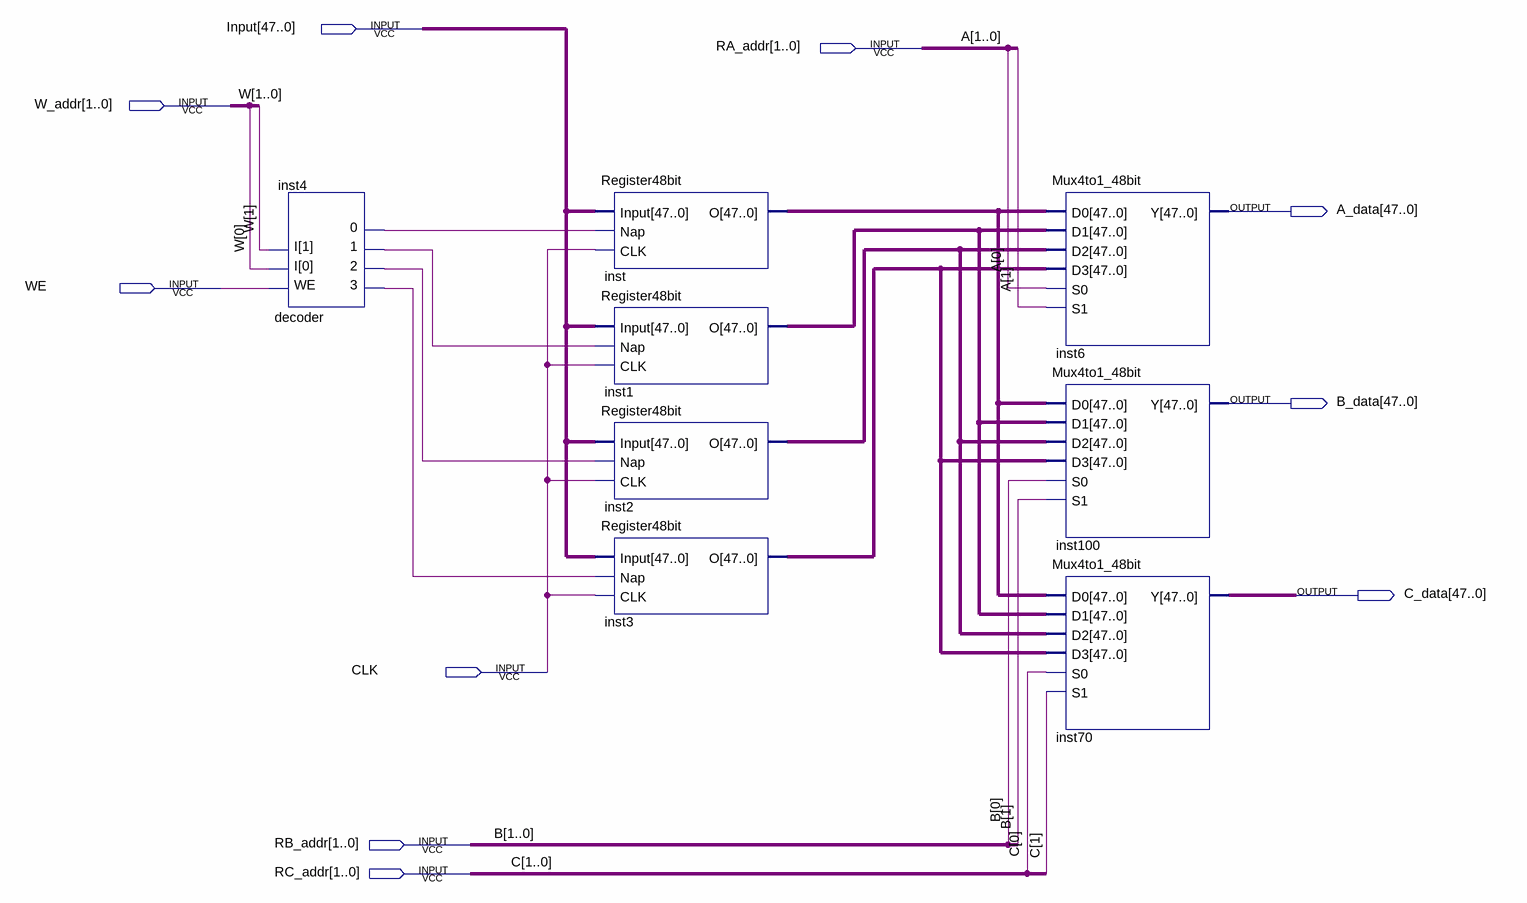
[diagram p0: schematic sheet]
// Quartus schematic Register4_48bit.bdf as structural Verilog: 8 symbols, 10 pins
module Register4_48bit (
  input  [47:0] Input,
  input  [1:0] RA_addr,
  input  [1:0] W_addr,
  input  WE,
  input  CLK,
  input  [1:0] RB_addr,
  input  [1:0] RC_addr,
  output [47:0] A_data,
  output [47:0] B_data,
  output [47:0] C_data
);

  wire inst4_0, inst4_1, inst4_2, inst4_3;
  wire [47:0] inst1_o, inst2_o, inst3_o, inst_o;

  decoder inst4 (.WE(WE), .I(W_addr), .\3 (inst4_3), .\2 (inst4_2), .\1 (inst4_1), .\0 (inst4_0));
  Register48bit inst (.Input(Input), .Nap(inst4_0), .CLK(CLK), .O(inst_o));
  Register48bit inst1 (.Input(Input), .Nap(inst4_1), .CLK(CLK), .O(inst1_o));
  Register48bit inst2 (.Input(Input), .Nap(inst4_2), .CLK(CLK), .O(inst2_o));
  Register48bit inst3 (.Input(Input), .Nap(inst4_3), .CLK(CLK), .O(inst3_o));
  Mux4to1_48bit inst6 (
    .D0(inst_o), .D1(inst1_o), .D2(inst2_o), .D3(inst3_o), .S0(RA_addr[0]), .S1(RA_addr[1]), .Y(A_data));
  Mux4to1_48bit inst100 (
    .D0(inst_o), .D1(inst1_o), .D2(inst2_o), .D3(inst3_o), .S0(RB_addr[0]), .S1(RB_addr[1]), .Y(B_data));
  Mux4to1_48bit inst70 (
    .D0(inst_o), .D1(inst1_o), .D2(inst2_o), .D3(inst3_o), .S0(RC_addr[0]), .S1(RC_addr[1]), .Y(C_data));

  // Other names for the same wires on the sheet: A[1:0] = RA_addr; B[1:0] = RB_addr; C[1:0] = RC_addr;
  //   W[1:0] = W_addr
endmodule
